# Altium project Encoder-25.PrjPcb
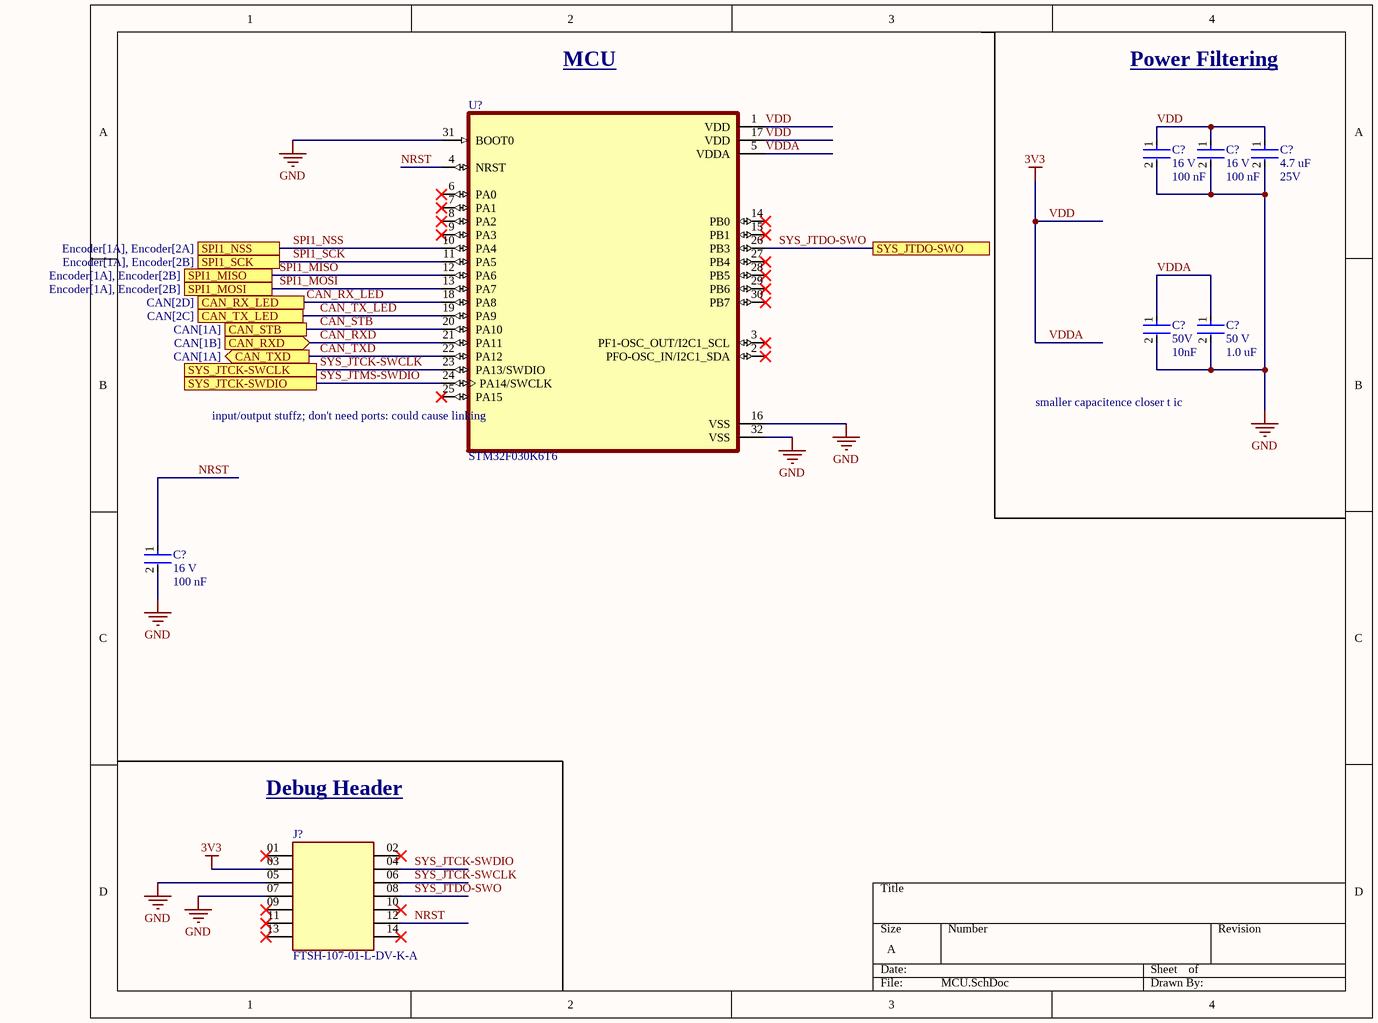
[diagram p0: MCU.SchDoc]
4 sheets, 27 parts. Net scope: flat (ports and power ports of the same name join across sheets).
Sheets:
  MCU.SchDoc
  CAN.SchDoc
  Encoder.SchDoc
  3V3_5V.SchDoc

## Sheet MCU.SchDoc
size A; SheetNumber: 1; SheetTotal: 5

### Parts
(Parts that share a designator on the sheet are numbered #1, #2 ... from top to bottom, then left to right.)
C?#1  Voltage Rating: 16 V  Capacitance: 100 nF  [CAP-0402]  (hidden comment: CC0402KRX7R7BB104)
C?#2  Voltage Rating: 16 V  Capacitance: 100 nF  [CAP-0402]  (hidden comment: CC0402KRX7R7BB104)
C?#3  Capacitance: 4.7 uF  Voltage: 25V  [CAP-0603]  (hidden comment: CC0603KRX5R8BB475)
C?#4  Voltage: 50V  Capacitance: 10nF  [CAP-0805]  (hidden comment: GRM2195C1H103JA01D)
C?#5  Voltage: 50 V  Capacitance: 1.0 uF  [CAP-0805]  (hidden comment: CC0805KKX7R9BB105)
C?#6  Voltage Rating: 16 V  Capacitance: 100 nF  [CAP-0402]  (hidden comment: CC0402KRX7R7BB104)
J?#1  FTSH-107-01-L-DV-K-A  [CONN-14POS-0001]
U?#1  STM32F030K6T6  [QFP80P900X900X160-32N]

### Ports
CAN_RX_LED (see CAN[2D]), CAN_RXD (in, see CAN[1B]), CAN_STB (see CAN[1A]), CAN_TX_LED (see CAN[2C]), CAN_TXD (out, see CAN[1A]), SPI1_MISO (see Encoder[1A], Encoder[2B]), SPI1_MOSI (see Encoder[1A], Encoder[2B]), SPI1_NSS (see Encoder[1A], Encoder[2A]), SPI1_SCK (see Encoder[1A], Encoder[2B]), SYS_JTCK-SWCLK, SYS_JTCK-SWDIO, SYS_JTDO-SWO

### Nets
3V3: C?#1.1 C?#2.1 C?#3.1 C?#4.1 C?#5.1 J?#1.03 U?#1.1(VDD) U?#1.5(VDDA) U?#1.17(VDD)  [also labelled VDD, VDDA]  [project net 3V3 Out]
GND: C?#1.2 C?#2.2 C?#3.2 C?#4.2 C?#5.2 C?#6.2 J?#1.05 J?#1.07 U?#1.16(VSS) U?#1.31(BOOT0) U?#1.32(VSS)
CAN_RX_LED: U?#1.18(PA8) ; port CAN_RX_LED
CAN_RXD: U?#1.21(PA11) ; port CAN_RXD
CAN_STB: U?#1.20(PA10) ; port CAN_STB
CAN_TX_LED: U?#1.19(PA9) ; port CAN_TX_LED
CAN_TXD: U?#1.22(PA12) ; port CAN_TXD
NRST: C?#6.1 J?#1.12 U?#1.4(NRST)
SPI1_MISO: U?#1.12(PA6) ; port SPI1_MISO
SPI1_MOSI: U?#1.13(PA7) ; port SPI1_MOSI
SPI1_NSS: U?#1.10(PA4) ; port SPI1_NSS
SPI1_SCK: U?#1.11(PA5) ; port SPI1_SCK
SYS_JTCK-SWCLK: J?#1.06 U?#1.23(PA13/SWDIO) ; port SYS_JTCK-SWCLK
SYS_JTCK-SWDIO: J?#1.04
SYS_JTDO-SWO: J?#1.08 U?#1.26(PB3) ; port SYS_JTDO-SWO
SYS_JTMS-SWDIO: U?#1.24(PA14/SWCLK) ; port SYS_JTCK-SWDIO

Not connected (* = marked no-connect by the designer): J?#1 01* 02* 09* 10* 11* 13* 14*; U?#1 2(PFO-OSC_IN/I2C1_SDA)* 3(PF1-OSC_OUT/I2C1_SCL)* 6(PA0)* 7(PA1)* 8(PA2)* 9(PA3)* 14(PB0)* 15(PB1)* 25(PA15)* 27(PB4)* 28(PB5)* 29(PB6)* 30(PB7)*

### Notes on the sheet
- MCU
- Power Filtering
- (near U?#1) input/output stuffz; don't need ports: could cause linking
- smaller capacitence closer t ic
- Debug Header

### Library data of the parts
C?#1 C?#2 C?#6 = CAP-0.1U-0001: CAP CER 0.1UF 16V X7R 0402; ComponentLink2Description: Datasheet; ComponentLink2URL: https://www.yageo.com/upload/media/product/productsearch/datasheet/mlcc/UPY-GPHC_X7R_6.3V-to-250V_24.pdf; Device Class: Ceramic; Size: 0402
C?#3 = CAP-4.7U-0001: CAP CER 4.7UF 25V X5R 0603; Device Class: Ceramic; Size: 0603
C?#4 = CAP-10N-0001: CAP CER 10000PF 50V C0G/NP0 0805; Device Class: Ceramic; Size: 0805; ComponentLink1Description: Datasheet; ComponentLink1URL: https://search.murata.co.jp/Ceramy/image/img/A01X/G101/ENG/GRM2195C1H103JA01-01.pdf
C?#5 = CAP-1U-0001: CAP CER 1UF 50V X7R 0805; ComponentLink2URL: https://www.yageo.com/upload/media/product/productsearch/datasheet/mlcc/UPY-GPHC_X7R_6.3V-to-250V_24.pdf; ComponentLink2Description: Datasheet; Device Class: Ceramic; Size: 0805
J?#1 = CONN-14POS-0001_1: Connector Header Surface Mount 14 position 0.050 (1.27mm); MF: Samtec Inc.; SnapEDA_Link: https://www.snapeda.com/parts/FTSH-107-01-L-DV-K-A/Samtec+Inc./view-part/?ref=snap; Package: None; Value: *; MP: FTSH-107-01-L-DV-K-A; Check_prices: https://www.snapeda.com/parts/FTSH-107-01-L-DV-K-A/Samtec+Inc./view-part/?ref=eda
U?#1 = IC-STM 32 BIT 32 KB 32 LQFP: ARMÂ® CortexÂ®-M0 STM32F0 Microcontroller IC 32-Bit Single-Core 48MHz 32KB (32K x 8) FLASH 32-LQFP (7x7); MF: STMicroelectronics; Check_prices: https://www.snapeda.com/parts/STM32F030K6T6/STMicroelectronics/view-part/?ref=eda; Digi-Key_Part_Number: 497-14046-ND; Package: LQFP-32 STMicroelectronics; MP: STM32F030K6T6; Value: *; SnapEDA_Link: https://www.snapeda.com/parts/STM32F030K6T6/STMicroelectronics/view-part/?ref=snap; Purchase-URL: https://pricing.snapeda.com/search/part/STM32F030K6T6/?ref=eda

## Sheet CAN.SchDoc
size A; SheetNumber: 2; SheetTotal: 5
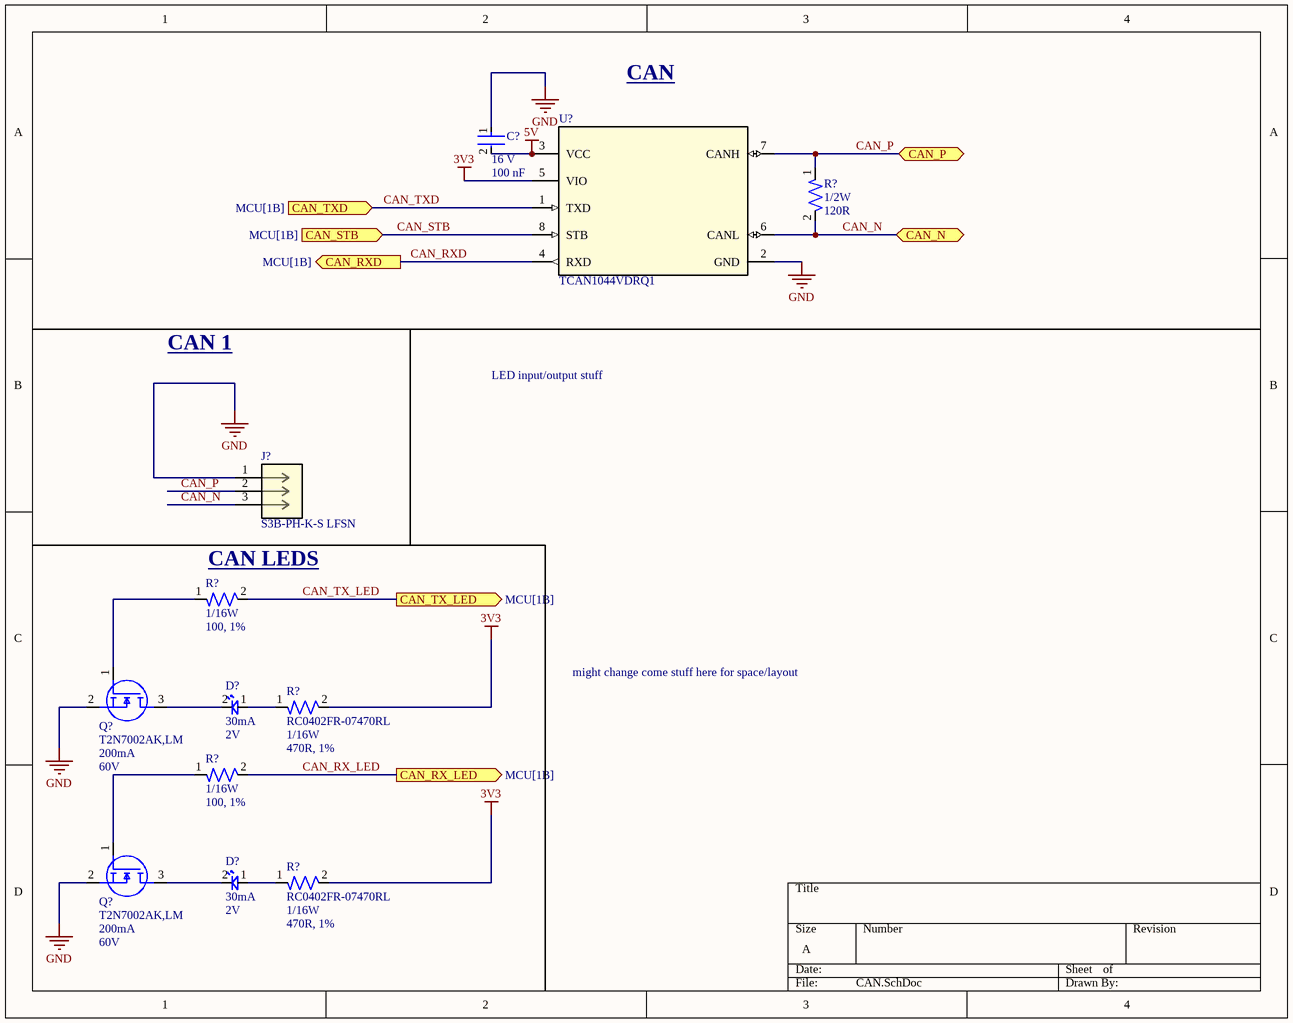
[diagram p1: CAN.SchDoc]

### Parts
(Parts that share a designator on the sheet are numbered #1, #2 ... from top to bottom, then left to right.)
C?#7  Voltage Rating: 16 V  Capacitance: 100 nF  [CAP-0402]  (hidden comment: CC0402KRX7R7BB104)
D?#1  Current Rating: 30mA  Vf: 2V  [LED0603-R-RD]  (hidden comment: BL-HKC36G-AV-TRB)
D?#2  Current Rating: 30mA  Vf: 2V  [LED0603-R-RD]  (hidden comment: BL-HKC36G-AV-TRB)
J?#2  S3B-PH-K-S LFSN  [CONN-3POS-JST]
Q?#1  T2N7002AK,LM  Id-Continuous: 200mA  VDS-Max: 60V  [NMOS-SOT23-3]
Q?#2  T2N7002AK,LM  Id-Continuous: 200mA  VDS-Max: 60V  [NMOS-SOT23-3]
R?#1  Power: 1/2W  Resistance: 120R  [RES-1210]  (hidden comment: RC1210FR-07120RL)
R?#2  Power: 1/16W  Resistance: 100, 1%  [RESC1005X40X25NL05T10]  (hidden comment: RC0402FR-07100RL)
R?#3  RC0402FR-07470RL  Power: 1/16W  Resistance: 470R, 1%  [RESC1005X40X25NL05T10]
R?#4  Power: 1/16W  Resistance: 100, 1%  [RESC1005X40X25NL05T10]  (hidden comment: RC0402FR-07100RL)
R?#5  RC0402FR-07470RL  Power: 1/16W  Resistance: 470R, 1%  [RESC1005X40X25NL05T10]
U?#2  TCAN1044VDRQ1  [IC-8SOIC]

### Ports
CAN_N (bidir), CAN_P (bidir), CAN_RX_LED (out, see MCU[1B]), CAN_RXD (out, see MCU[1B]), CAN_STB (in, see MCU[1B]), CAN_TX_LED (out, see MCU[1B]), CAN_TXD (in, see MCU[1B])

### Nets
3V3: R?#3.2 R?#5.2 U?#2.5(VIO)  [project net 3V3 Out]
5V: C?#7.2 U?#2.3(VCC)
GND: C?#7.1 J?#2.1 Q?#1.2(S) Q?#2.2(S) U?#2.2(GND)
CAN_N: J?#2.3 R?#1.2 U?#2.6(CANL) ; port CAN_N
CAN_P: J?#2.2 R?#1.1 U?#2.7(CANH) ; port CAN_P
CAN_RX_LED: R?#4.2 ; port CAN_RX_LED
CAN_RXD: U?#2.4(RXD) ; port CAN_RXD
CAN_STB: U?#2.8(STB) ; port CAN_STB
CAN_TX_LED: R?#2.2 ; port CAN_TX_LED
CAN_TXD: U?#2.1(TXD) ; port CAN_TXD
NetD?#1_1: D?#1.1 R?#3.1
NetD?#1_2: D?#1.2 Q?#1.3(D)
NetD?#2_1: D?#2.1 R?#5.1
NetD?#2_2: D?#2.2 Q?#2.3(D)
NetQ?#1_1: Q?#1.1(G) R?#2.1
NetQ?#2_1: Q?#2.1(G) R?#4.1

### Notes on the sheet
- CAN
- CAN 1
- LED input/output stuff
- CAN LEDS
- might change come stuff here for space/layout

### Library data of the parts
C?#7 = CAP-0.1U-0001: CAP CER 0.1UF 16V X7R 0402; ComponentLink2Description: Datasheet; ComponentLink2URL: https://www.yageo.com/upload/media/product/productsearch/datasheet/mlcc/UPY-GPHC_X7R_6.3V-to-250V_24.pdf; Device Class: Ceramic; Size: 0402
D?#1 D?#2 = LED-0001: LED YELLOW CLEAR 0603 SMD
J?#2 = CONN-3POS-JST: CONN HEADER R/A 3POS 2MM; Mfr_Name: JST; Digi-Key_Part_Number_1: 455-1720-ND; RefDes: RefDes; Type: Type
Q?#1 Q?#2 = NMOS-200MA-0001: MOSFET N-CH 60V 200MA SOT23; Manufacturer: Toshiba; FET type: N-Channel; Rds On-Max: 3.9Ohm; Vgs-Max: 20V; Assembled?: no; Manufacturer Part Number: T2N7002AK,LM; Package: SOT-23-3
R?#1 = RES-120-0001: RES 120 OHM 1% 1/2W 1210; Tolerance: 1%; Size: 1210; ComponentLink1Description: Datasheet; ComponentLink1URL: https://www.yageo.com/upload/media/product/products/datasheet/rchip/PYu-RC_Group_51_RoHS_L_12.pdf
R?#2 R?#4 = RES-100-0001: RES 100 OHM 1% 1/16W 0402; Max Power Dissipation: 63mW; Voltage Rating (DC): 50V; Temperature Coefficient: 100ppm/°C; Power Rating: 62.5mW; Technology: THICK FILM; Size Code: 0402; Series: RC; Length: 1mm; Case/Package: 0402; Features: Moisture Resistant; Termination: SMD/SMT; Case Code (Metric): 1005; Reach SVHC Compliant: Yes; Number of Terminations: 2; Tolerance: 1%; Lead Free: Lead Free; Military Standard: Not; Resistor Type: Thick Film; Max Operating Temperature: 155°C; RoHS Compliant: Yes; Construction: Rectangular; Voltage Rating: 50V; Packaging: Tape and Reel; Height: 0.32mm; Number of Pins: 2; Resistance Tolerance: 1%; Case Code (Imperial): 0402; Depth: 0.5mm; Min Operating Temperature: -55°C; Width: 0.5mm
R?#3 R?#5 = RES-470-0001: 470 Ohms ±1% 0.063W, 1/16W Chip Resistor 0402 (1005 Metric) Moisture Resistant Thick Film; Manufacturer: Yageo / Phycomp; Part Number: RC0402FR-07470RL
U?#2 = IC-CAN-0001: IC TRANSCEIVER 1/1 8SOIC; ComponentLink1Description: Datasheet; ComponentLink1URL: https://www.ti.com/lit/ds/symlink/tcan1044-q1.pdf?HQS=dis-dk-null-digikeymode-dsf-pf-null-wwe&ts=1728758303289&ref_url=https%253A%252F%252Fwww.ti.com%252Fgeneral%252Fdocs%252Fsuppproductinfo.tsp%253FdistId%253D10%2526gotoUrl%253Dhttps%253A%252F%252Fwww.ti.com%252Flit%252Fgpn%252Ftcan1044-q1

## Sheet Encoder.SchDoc
size A; SheetNumber: 3; SheetTotal: 5
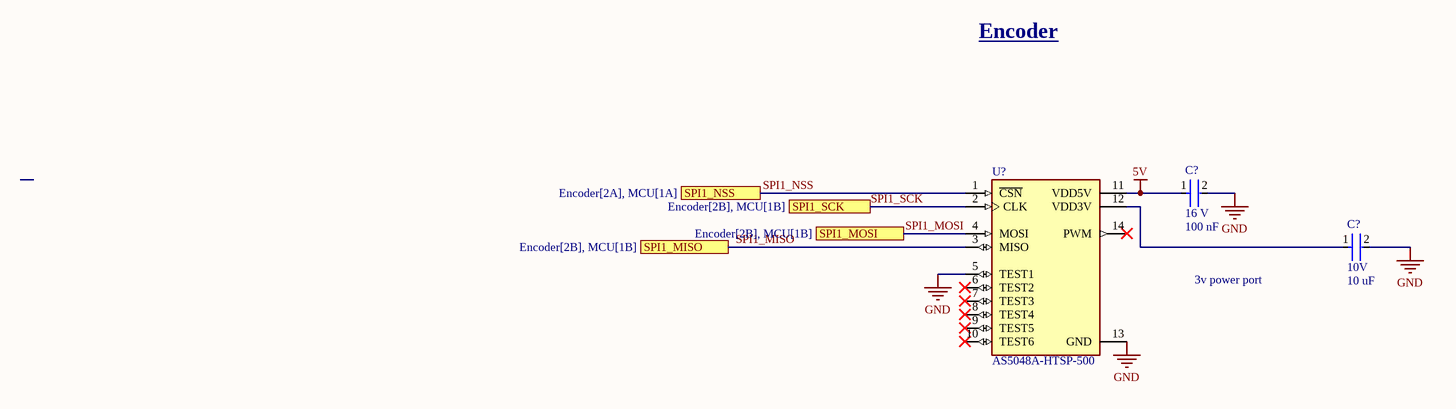
[diagram p2: Encoder.SchDoc]

### Parts
(Parts that share a designator on the sheet are numbered #1, #2 ... from top to bottom, then left to right.)
C?#8  Voltage Rating: 16 V  Capacitance: 100 nF  [CAP-0402]  (hidden comment: CC0402KRX7R7BB104)
C?#9  Voltage: 10V  Capacitance: 10 uF  [CAP-0603]  (hidden comment: CC0603KRX5R6BB106)
U?#3  AS5048A-HTSP-500  [SOP65P640X120-14N]

### Ports
SPI1_MISO (see Encoder[2B], MCU[1B]), SPI1_MOSI (see Encoder[2B], MCU[1B]), SPI1_NSS (see Encoder[2A], MCU[1A]), SPI1_SCK (see Encoder[2B], MCU[1B])

### Nets
5V: C?#8.1 U?#3.11(VDD5V)
GND: C?#8.2 C?#9.2 U?#3.5(TEST1) U?#3.13(GND)
SPI1_MISO: U?#3.3(MISO) ; port SPI1_MISO
SPI1_MOSI: U?#3.4(MOSI) ; port SPI1_MOSI
SPI1_NSS: U?#3.1(~{CSN}) ; port SPI1_NSS
SPI1_SCK: U?#3.2(CLK) ; port SPI1_SCK
NetC?#9_1: C?#9.1 U?#3.12(VDD3V)

Not connected (* = marked no-connect by the designer): U?#3 6(TEST2)* 7(TEST3)* 8(TEST4)* 9(TEST5)* 10(TEST6)* 14(PWM)*

### Notes on the sheet
- Encoder
- 3v power port

### Library data of the parts
C?#8 = CAP-0.1U-0001: CAP CER 0.1UF 16V X7R 0402; ComponentLink2Description: Datasheet; ComponentLink2URL: https://www.yageo.com/upload/media/product/productsearch/datasheet/mlcc/UPY-GPHC_X7R_6.3V-to-250V_24.pdf; Device Class: Ceramic; Size: 0402
C?#9 = CAP-10U-0001: CAP CER 10UF 10V X5R 0603; ComponentLink1Description: Datasheet; ComponentLink1URL: https://www.yageo.com/upload/media/product/app/datasheet/mlcc/upy-gphc_x5r_4v-to-50v.pdf; Device Class: Ceramic; Size: 0603
U?#3 = ASB-ENCODER-SENSOR: Hall Effect Sensor Angle External Magnet, Not Included Gull Wing; MF: ams; SnapEDA_Link: https://www.snapeda.com/parts/AS5048A-HTSP-500/ams/view-part/?ref=snap; Package: TSSOP-14 ams; Value: *; MP: AS5048A-HTSP-500; Check_prices: https://www.snapeda.com/parts/AS5048A-HTSP-500/ams/view-part/?ref=eda

## Sheet 3V3_5V.SchDoc
size A; SheetNumber: 4; SheetTotal: 5
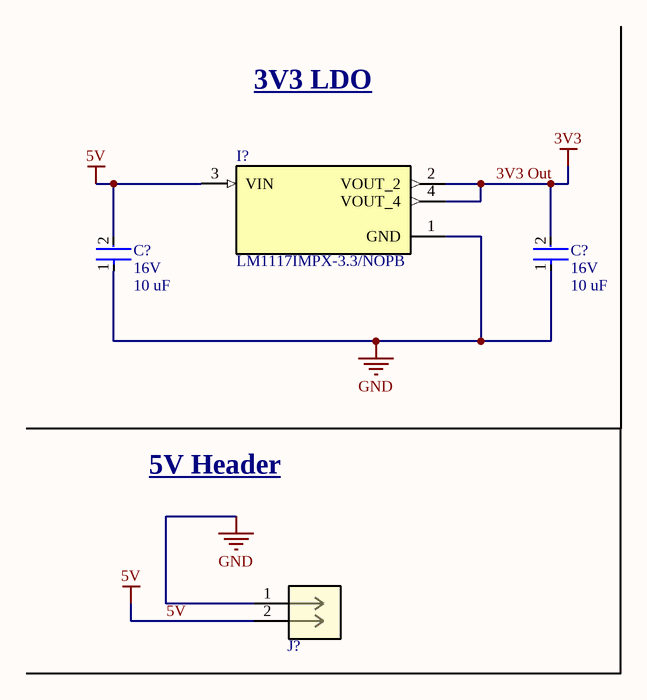
[diagram p3: 3V3_5V.SchDoc]

### Parts
(Parts that share a designator on the sheet are numbered #1, #2 ... from top to bottom, then left to right.)
C?#10  Voltage: 16V  Capacitance: 10 uF  [CAP-1206]  (hidden comment: 293D106X9016A2TE3)
C?#11  Voltage: 16V  Capacitance: 10 uF  [CAP-1206]  (hidden comment: 293D106X9016A2TE3)
I?  LM1117IMPX-3.3/NOPB  [IC-SOT-223-4]
J?#3  S2B-PH-K-SLFSN  [CONN-2POS-JST]  (value not drawn)

### Nets
3V3 Out: C?#11.2 I?.2(VOUT_2) I?.4(VOUT_4)  [also labelled 3V3]
5V: C?#10.2 I?.3(VIN) J?#3.2
GND: C?#10.1 C?#11.1 I?.1(GND) J?#3.1

### Notes on the sheet
- 3V3 LDO
- 5V Header

### Library data of the parts
C?#10 C?#11 = CAP-10U-0004: CAP TANT 10UF 10% 16V 1206; Device Class: Tantalum; Size: 1206; ComponentLink1Description: Datasheet; ComponentLink1URL: https://www.lcsc.com/datasheet/lcsc_datasheet_2304140030_Vishay-Intertech-293D106X9016A2TE3_C110038.pdf
I? = IC_LDO_3V3_0001: IC REG LIN 3.3V 800MA SOT223-4; ComponentLink1Description: New link; ComponentLink1URL: https://www.ti.com/lit/ds/symlink/lm1117.pdf?HQS=dis-dk-null-digikeymode-dsf-pf-null-wwe&ts=1721700739746
J?#3 = CONN-2POS-JST: Connector Header Through Hole, Right Angle 2 position 0.079" (2.00mm); Mfr_Name: JST; RefDes: RefDes; Type: Type

## Nets that join several sheets
3V3 Out: MCU (9 pins), CAN (R?#3.2 R?#5.2 U?#2.5), 3V3_5V (C?#11.2 I?.2 I?.4)
5V: CAN (C?#7.2 U?#2.3), Encoder (C?#8.1 U?#3.11), 3V3_5V (C?#10.2 I?.3 J?#3.2)
GND: MCU (11 pins), CAN (5 pins), Encoder (C?#8.2 C?#9.2 U?#3.5 U?#3.13), 3V3_5V (C?#10.1 C?#11.1 I?.1 J?#3.1)
CAN_RX_LED: MCU (U?#1.18), CAN (R?#4.2)
CAN_RXD: MCU (U?#1.21), CAN (U?#2.4)
CAN_STB: MCU (U?#1.20), CAN (U?#2.8)
CAN_TX_LED: MCU (U?#1.19), CAN (R?#2.2)
CAN_TXD: MCU (U?#1.22), CAN (U?#2.1)
SPI1_MISO: MCU (U?#1.12), Encoder (U?#3.3)
SPI1_MOSI: MCU (U?#1.13), Encoder (U?#3.4)
SPI1_NSS: MCU (U?#1.10), Encoder (U?#3.1)
SPI1_SCK: MCU (U?#1.11), Encoder (U?#3.2)